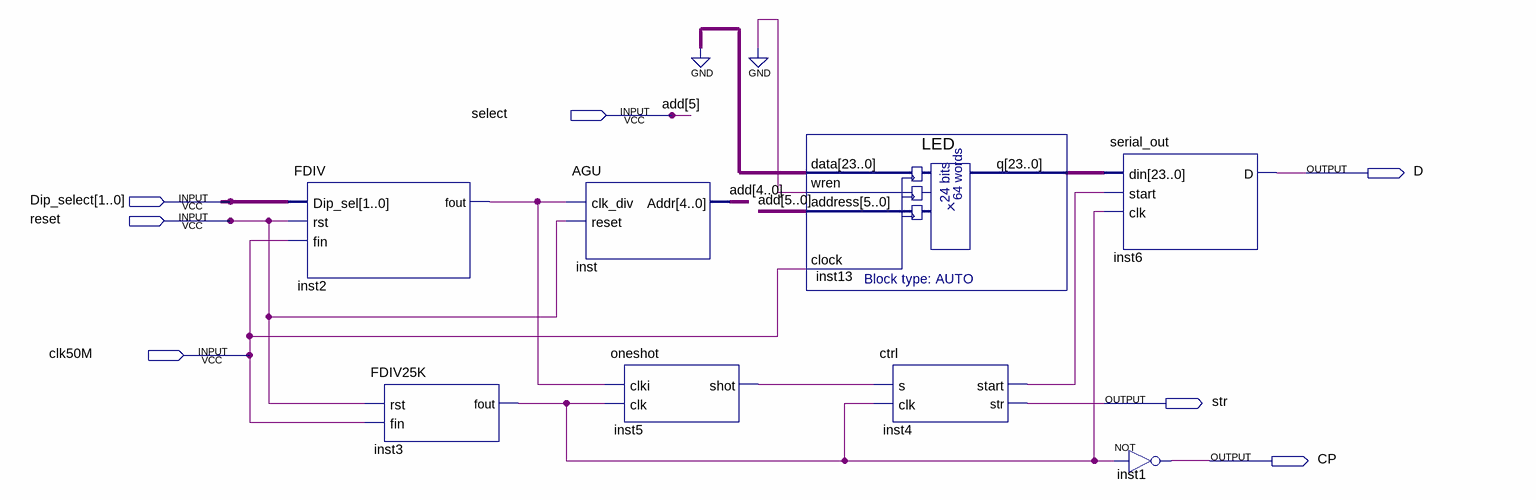
[diagram p0: schematic sheet]
// Quartus schematic hw5.bdf as structural Verilog: 8 symbols, 7 pins
module hw5 (
  input  select,
  input  [1:0] Dip_select,
  input  reset,
  input  clk50M,
  output D,
  output str,
  output CP
);

  wire inst2_fout, inst3_fout, inst4_start, inst5_shot;
  wire [4:0] add;
  wire [23:0] inst13_q;

  FDIV inst2 (.Dip_sel(Dip_select), .rst(reset), .fin(clk50M), .fout(inst2_fout));
  FDIV25K inst3 (.rst(reset), .fin(clk50M), .fout(inst3_fout));
  AGU inst (.clk_div(inst2_fout), .reset(reset), .Addr(add));
  oneshot inst5 (.clki(inst2_fout), .clk(inst3_fout), .shot(inst5_shot));
  LED inst13 (.data({24{1'b0}}), .wren(1'b0), .address({select, add}), .clock(clk50M), .q(inst13_q));
  ctrl inst4 (.s(inst5_shot), .clk(inst3_fout), .start(inst4_start), .str(str));
  serial_out inst6 (.din(inst13_q), .start(inst4_start), .clk(inst3_fout), .D(D));
  not inst1 (CP, inst3_fout);

  // Other names for the same wires on the sheet: add[5] = select
endmodule
